# EAGLE design Sensor_Board_0x12_U-Value (EAGLE 8.2.2)
AUTOR: Luca Brügger
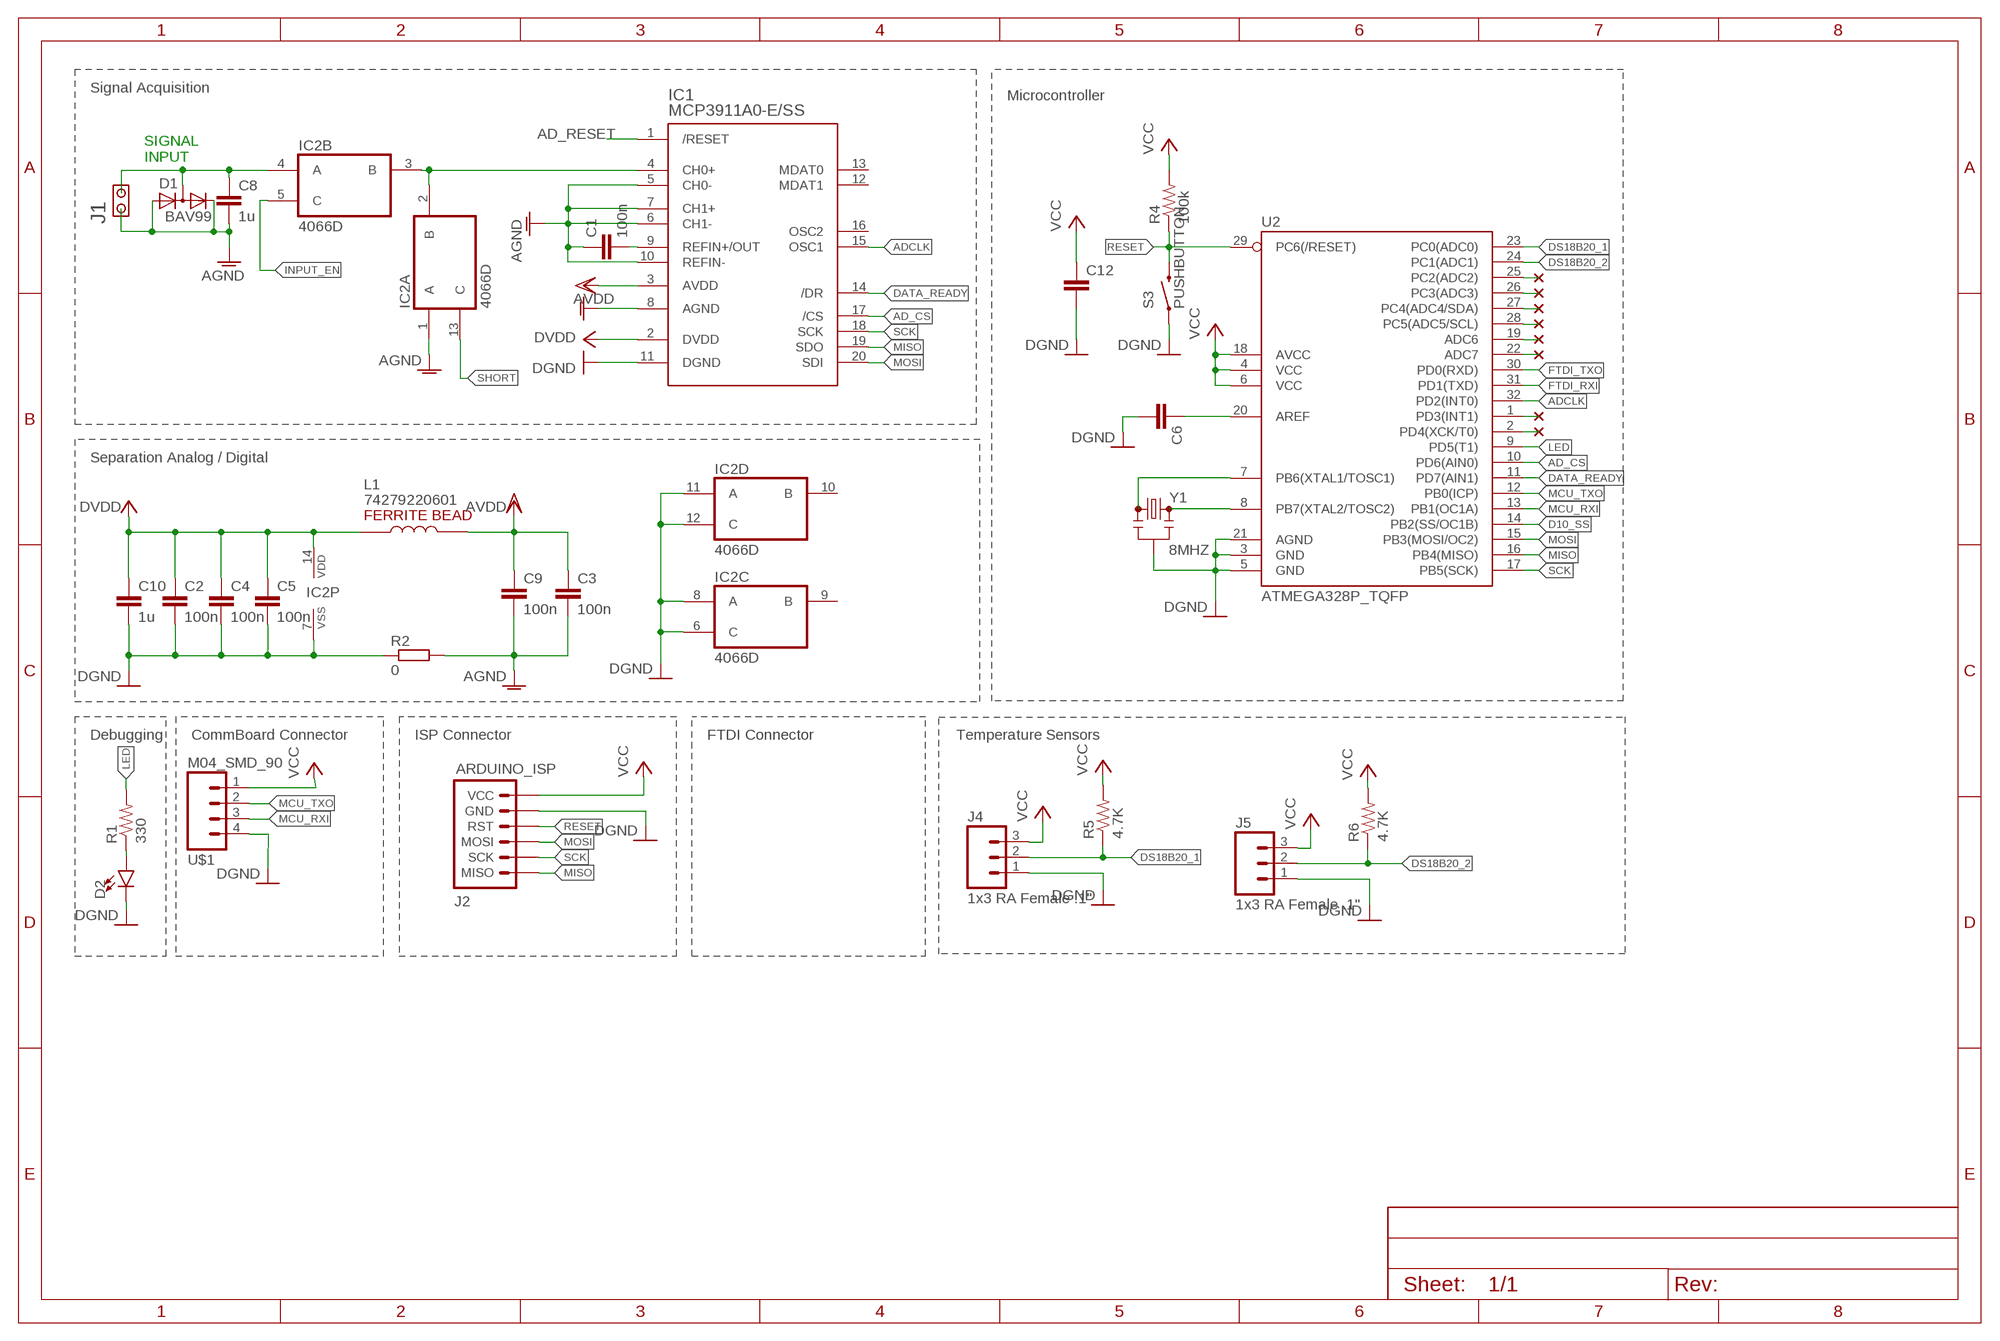
[diagram p0: schematic, sheet 1]
FRAME2 (FRAME-A4L): CNAME: Sensor Board 0x12 U-Value; CREVISION: 1.0

## Parts
C1  100n  C-EUC0805  [C0805]
C2  100n  C-EUC0805  [C0805]
C3  100n  C-EUC0805  [C0805]
C4  100n  C-EUC0805  [C0805]
C5  100n  C-EUC0805  [C0805]
C6  CAP0805  [0805]
C8  1u  C-EUC0805  [C0805]
C9  100n  C-EUC0805  [C0805]
C10  1u  C-EUC0805  [C0805]
C12  CAP0805  [0805]
D1  BAV99  [SOT23]
D2  LED0603  [LED-0603]
IC1  MCP3911A0-E/SS  [SSOP20]
IC2  4066D  [SO14]
J1  CON2X1  [CON2X1]
J2  ARDUINO_ISP  [M-2X3]
J4  1x3 RA Female .1"  M03SMD_RA_FEMALE  [1X03_SMD_RA_FEMALE]
J5  1x3 RA Female .1"  M03SMD_RA_FEMALE  [1X03_SMD_RA_FEMALE]
L1  74279220601  [0805]
R1  330  RESISTOR0805-RES  [0805]
R2  0  R-EU_M0805  [M0805]
R4  100k  RESISTOR0805-RES  [0805]
R5  4.7K  RESISTOR0805-RES  [0805]
R6  4.7K  RESISTOR0805-RES  [0805]
S3  PUSHBUTTON  [M-PUSHBUTTON-SMD]
U2  ATMEGA328P_TQFP  [TQFP32-08]
U$1  M04_SMD_90  [M04_SMD_90]
Y1  8MHZ  RESONATOR8MHZ  [RESONATOR-SMD]

## Nets
AD_CS: IC1.17(/CS) U2.10(PD6(AIN0))
AD_RESET: IC1.1(/RESET)
ADCLK: IC1.15(OSC1) U2.32(PD2(INT0))
AGND: C1.1 C3.2 C8.2 C9.2 D1.1(A) D1.2(C) IC1.5(CH0-) IC1.6(CH1-) IC1.7(CH1+) IC1.8(AGND) IC1.10(REFIN-) IC2.1(A:A) J1.1 R2.2
AVDD: C3.1 C9.1 IC1.3(AVDD) L1.2
D10_SS: U2.14(PB2(SS/OC1B))
DATA_READY: IC1.14(/DR) U2.11(PD7(AIN1))
DGND: C2.2 C4.2 C5.2 C10.2 IC1.11(DGND) IC2.6(C:C) IC2.7(P:VSS) IC2.8(C:A) IC2.11(D:A) IC2.12(D:C) R2.1
DS18B20_1: J4.2 R5.1 U2.23(PC0(ADC0))
DS18B20_2: J5.2 R6.1 U2.24(PC1(ADC1))
DVDD: C2.1 C4.1 C5.1 C10.1 IC1.2(DVDD) IC2.14(P:VDD) L1.1
FTDI_RXI: U2.31(PD1(TXD))
FTDI_TXO: U2.30(PD0(RXD))
GND: C6.2 C12.2 D2.C J2.P$5(GND) J5.1 S3.1(LEFT) S3.2(LEFT) U2.3(GND) U2.5(GND) U2.21(AGND) Y1.2 ; supply symbol labelled DGND
INPUT_EN: IC2.5(B:C)
LED: R1.2 U2.9(PD5(T1))
MCU_RXI: U2.13(PB1(OC1A)) U$1.3
MCU_TXO: U2.12(PB0(ICP)) U$1.2
MISO: IC1.19(SDO) J2.P$1(MISO) U2.16(PB4(MISO))
MOSI: IC1.20(SDI) J2.P$3(MOSI) U2.15(PB3(MOSI/OC2))
N$2: C1.2 IC1.9(REFIN+/OUT)
N$3: C6.1 U2.20(AREF)
N$4: U$1.4
N$6: U2.25(PC2(ADC2))
N$7: U2.26(PC3(ADC3))
N$8: IC1.4(CH0+) IC2.2(A:B) IC2.3(B:B)
N$9: U2.27(PC4(ADC4/SDA))
N$10: U2.28(PC5(ADC5/SCL))
N$11: U2.19(ADC6)
N$12: C8.1 D1.3(AC) IC2.4(B:A) J1.2
N$13: U2.22(ADC7)
N$15: J4.1
N$17: U2.1(PD3(INT1))
N$18: U2.2(PD4(XCK/T0))
N$23: U2.8(PB7(XTAL2/TOSC2)) Y1.3
N$24: D2.A R1.1
N$25: U2.7(PB6(XTAL1/TOSC1)) Y1.1
RESET: J2.P$4(RST) R4.1 S3.3(RIGHT) S3.4(RIGHT) U2.29(PC6(/RESET))
SCK: IC1.18(SCK) J2.P$2(SCK) U2.17(PB5(SCK))
SHORT: IC2.13(A:C)
VCC: C12.1 J2.P$6(VCC) J4.3 J5.3 R4.2 R5.2 R6.2 U2.4(VCC) U2.6(VCC) U2.18(AVCC) U$1.1
Unconnected: IC1.12(MDAT1) IC1.13(MDAT0) IC1.16(OSC2) IC2.9(C:B) IC2.10(D:B)

## Notes on the sheet
- Signal Acquisition
- Microcontroller
- SIGNAL
  INPUT
- Separation Analog / Digital
- Debugging | CommBoard Connector | ISP Connector | FTDI Connector | Temperature Sensors

## Library data of the parts
C1-C5 C8-C10 = heatflow:C-EU: CAPACITOR, European symbol
C6 C12 = wsn:CAP: Capacitor Standard 0603 ceramic capacitor, and 0.1" leaded capacitor.
D1 = LEDXLamp:BAV99
D2 = wsn:LED: LED (Generic) Standard schematic elements and footprints for 5mm, 3mm, 1206, and 0603 sized LEDs. Generic LEDs with no color specified.
IC1 = heatflow:MCP3911A0-E/*
IC2 = 40xx:4066: Quad bilateral ANALOG SWITCH
J1 = Stecker_Pins:CON2X1: Pin-Leiste, 2*1
J2 = wsn:ARDUINO_ISP: AVR ISP 6-pin inline header for Arduino ISP
J4 J5 = wsn:M03: Header 3 Standard 3-pin 0.1" header. Use with straight break away headers (SKU : PRT-00116), right angle break away headers (PRT-00553), swiss pins (PRT-00743), machine pins (PRT-00117), and female headers (PRT-00115). Molex polarized connector foot print use with SKU : PRT-08232 with associated crimp pins and housings.; PROD_ID: CONN-10926
L1 = heatflow2:74279220601: Multilayer Bead SMD, Würth Elektronik Typ: 74279220601
R1 R4-R6 = wsn:RESISTOR: Resistor Basic schematic elements and footprints for 0603, 1206, and PTH resistors.
R2 = resistor:R-EU_: RESISTOR, European symbol
S3 = wsn:PUSHBUTTON
U2 = wsn:ATMEGA328P_TQFP; PROD_ID: IC-09069
U$1 = wsn:M04_SMD_90
Y1 = wsn:RESONATOR: Resonator Small SMD resonator. Used, eg, on the Arduino Pro/ Pro Mini boards. 8MHz- XTAL-08895 16MHz- XTAL-08900; PROD_ID: XTAL-08895

## Board
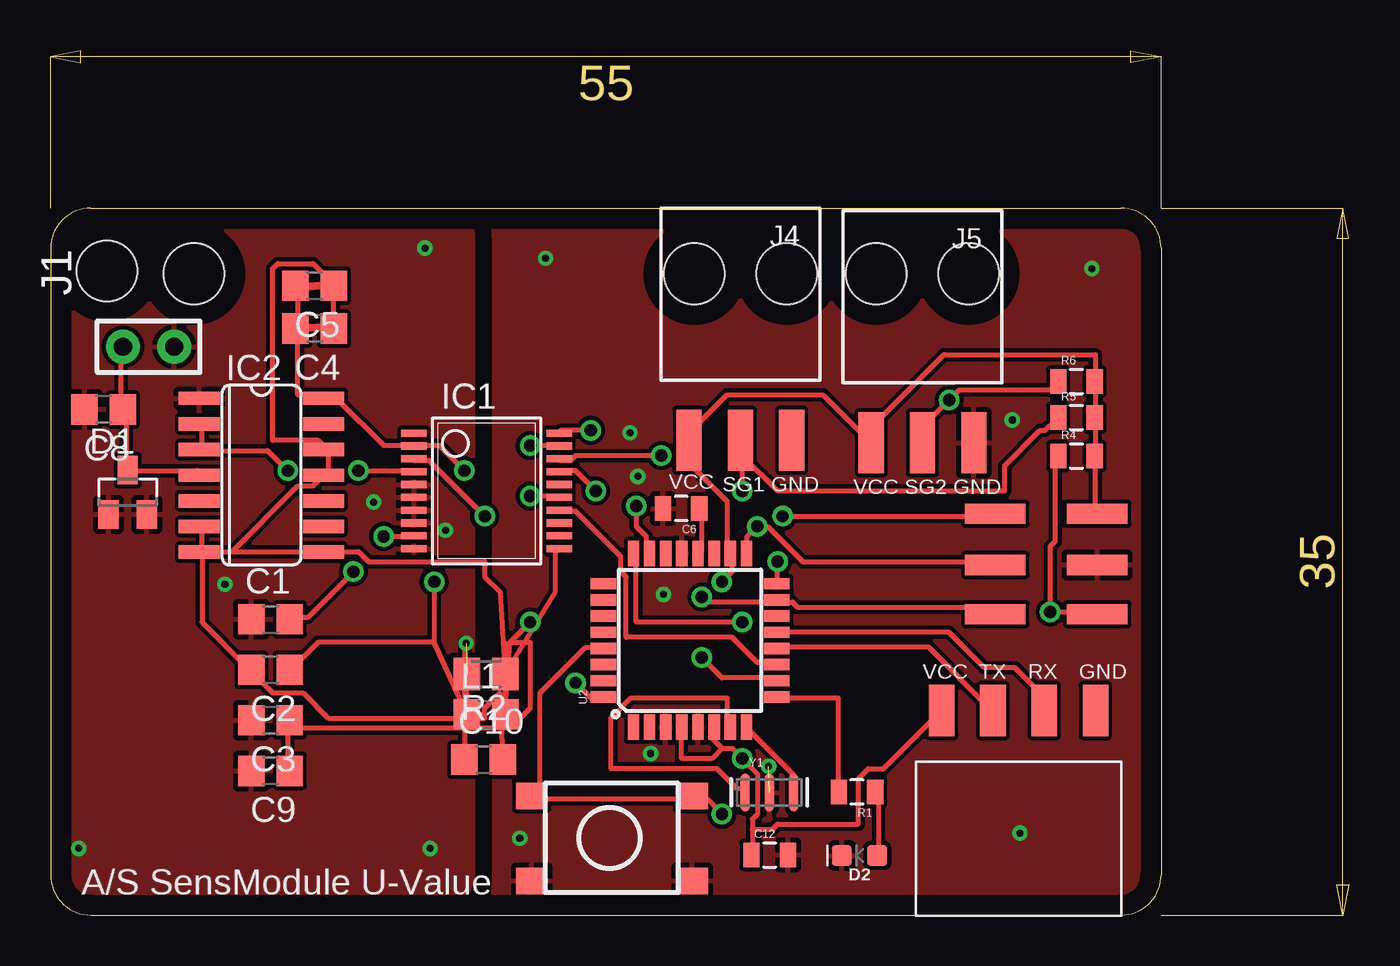
[diagram p1: board, top side]
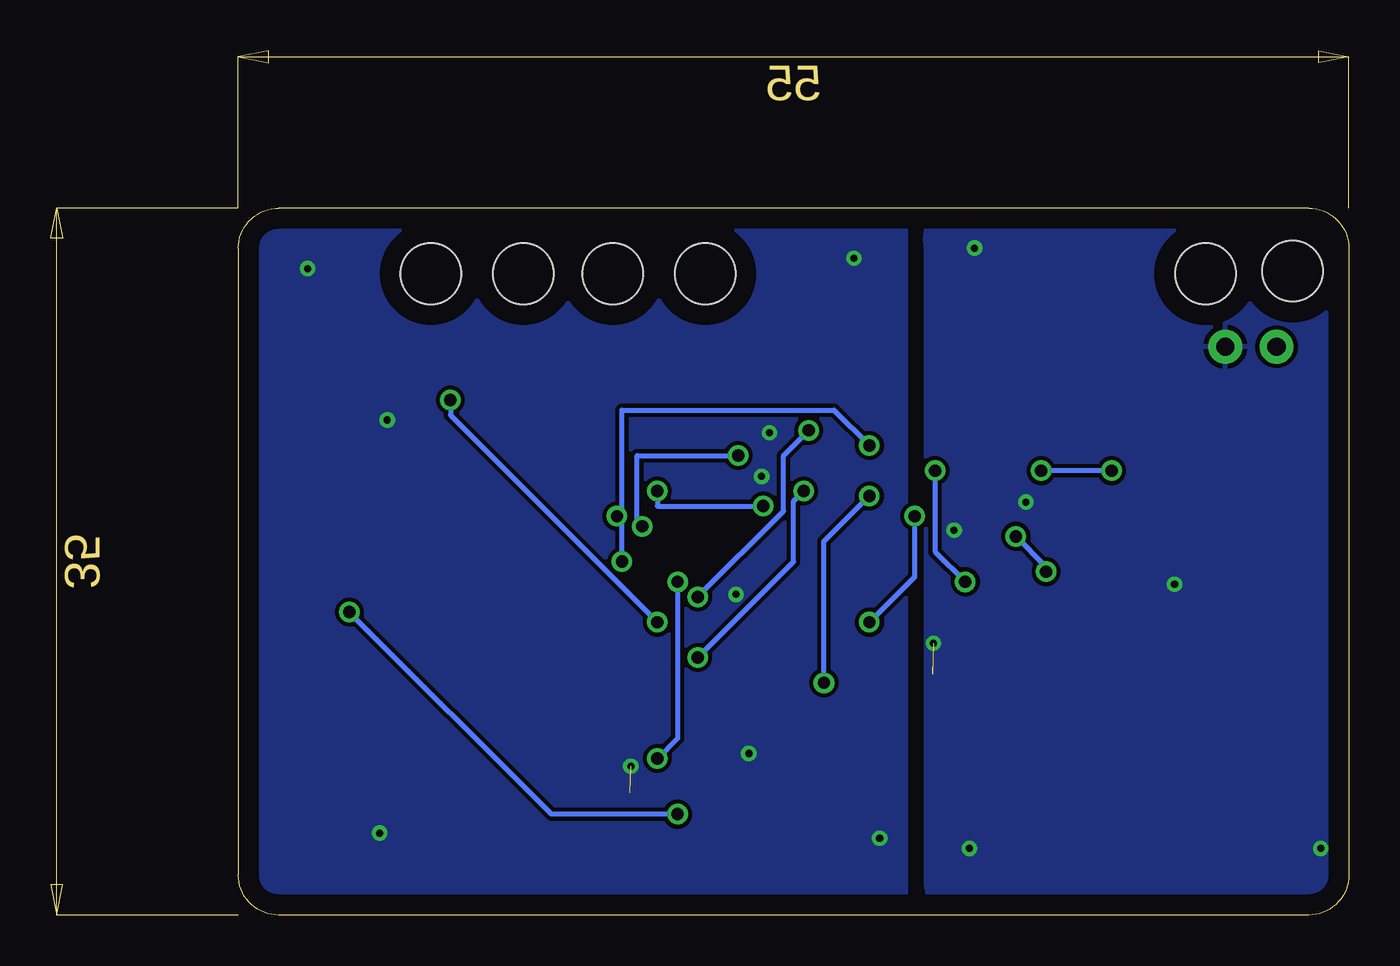
[diagram p2: board, bottom side, seen from below]

Size 55 x 35 mm. Coordinates in mm from the lower left corner, seen from the top.
Outline: 0,2 arc90 2,0 53,0 arc90 55,2 55,33 arc90 53,35 2,35 arc90 0,33 0,2
Copper layers (1*16): Top 0.035mm / dielectric 1.5mm / Bottom 0.035mm
Design rules "default *": minimum track width 10mil, minimum drill 24mil, track to track 8mil, track to pad 8mil, pad to pad 8mil, via to via 8mil, smd to smd 8mil, copper to edge 40mil, drill to drill 8mil, minimum pad ring 10mil, minimum via ring 8mil, stop-mask expansion 4mil, vias tented up to drill 0mil, thermal gap 10mil
Holes 3 mm at 2.79,31.88 7.11,31.75 31.88,31.75 40.89,31.75 36.45,31.75 45.47,31.75

### Footprints (pad centres in the part's own frame; a part is rotated, then mirrored left to right if it is on the bottom)
C0805 = smd 1.3 x 1.5: 1 -0.95,0; 2 0.95,0
0805 = smd 0.8 x 1.2: 1 -0.9,0; 2 0.9,0
SOT23 = smd 1 x 1.4: 1 -0.95,-1.1; 2 0.95,-1.1; 3 0,1.1
LED-0603 = smd 1 x 1: A -0.877,0; C 0.877,0
SSOP20 = smd 0.35 x 1.245: 1 -2.857,-3.45; 2 -2.222,-3.45; 3 -1.587,-3.45; 4 -0.952,-3.45; 5 -0.317,-3.45; 6 0.318,-3.45; 7 0.953,-3.45; 8 1.588,-3.45; 9 2.223,-3.45; 10 2.858,-3.45; 11 2.858,3.75; 12 2.223,3.75; 13 1.588,3.75; 14 0.953,3.75; 15 0.318,3.75; 16 -0.317,3.75; 17 -0.952,3.75; 18 -1.587,3.75; 19 -2.222,3.75; 20 -2.857,3.75
SO14 = smd 0.66 x 2.032: 1 -3.81,-3.073; 2 -2.54,-3.073; 3 -1.27,-3.073; 4 0,-3.073; 5 1.27,-3.073; 6 2.54,-3.073; 7 3.81,-3.073; 8 3.81,3.073; 9 2.54,3.073; 10 1.27,3.073; 11 0,3.073; 12 -1.27,3.073; 13 -2.54,3.073; 14 -3.81,3.073
CON2X1 = drill 0.9 pad 1.676: 1 0,0; 2 0,2.54
M-2X3 = smd 1 x 3: P$1 0,0; P$2 2.54,0; P$3 4.98,0; P$4 4.98,5.05; P$5 2.54,5.05; P$6 0,5.05
1X03_SMD_RA_FEMALE = smd 1.25 x 3: 1 -2.54,7.225; 2 0,7.225; 3 2.54,7.225
0805' = smd 1.3 x 1.5: 1 -0.95,0; 2 0.95,0
M0805 = smd 1.3 x 1.6: 1 -0.95,0; 2 0.95,0
M-PUSHBUTTON-SMD = smd 1.55 x 1.3: 1 0,0; 2 7.95,0; 3 0,-4.2; 4 7.95,-4.2
TQFP32-08 = smd 1.27 x 0.559: 1 -4.293,2.8; 2 -4.293,2; 3 -4.293,1.2; 4 -4.293,0.4; 5 -4.293,-0.4; 6 -4.293,-1.2; 7 -4.293,-2; 8 -4.293,-2.8; 17 4.293,-2.8; 18 4.293,-2; 19 4.293,-1.2; 20 4.293,-0.4; 21 4.293,0.4; 22 4.293,1.2; 23 4.293,2; 24 4.293,2.8 | smd 0.559 x 1.27: 9 -2.8,-4.293; 10 -2,-4.293; 11 -1.2,-4.293; 12 -0.4,-4.293; 13 0.4,-4.293; 14 1.2,-4.293; 15 2,-4.293; 16 2.8,-4.293; 25 2.8,4.293; 26 2,4.293; 27 1.2,4.293; 28 0.4,4.293; 29 -0.4,4.293; 30 -1.2,4.293; 31 -2,4.293; 32 -2.8,4.293
M04_SMD_90 = smd 1.27 x 2.54: 1 0,0; 2 2.54,0; 3 5.08,0; 4 7.62,0
RESONATOR-SMD = smd 0.45 x 1.905: 1 -1.2,0; 2 0,0; 3 1.2,0

### Placement (x,y rotation side)
C1  10.9,14.64 0 top
C2  10.9,12.14 180 top
C3  10.9,9.64 180 top
C4  13.08,29.03 180 top
C5  13.08,31.15 180 top
C6  31.23,20.13 180 top
C8  2.64,25.03 180 top
C9  10.9,7.14 180 top
C10  21.44,7.7 0 top
C12  35.61,2.98 0 top
D1  3.83,20.94 0 top
D2  40.06,2.95 180 top
IC1  21.44,21 270 top
IC2  10.44,21.78 270 top
J1  6.13,28.14 90 top
J2  46.78,19.87 270 top
J4  34.16,30.73 180 top
J5  43.18,30.61 180 top
L1  74279220601  [0805']  21.57,9.94 0 top
R1  39.94,6.09 180 top
R2  21.57,11.94 180 top
R4  50.8,22.73 0 top
R5  50.8,24.64 0 top
R6  50.8,26.42 0 top
S3  31.78,1.7 180 top
U2  31.67,13.6 90 top
U$1  44.13,10.13 0 top
Y1  35.59,6.07 0 top

### Tracks (layer width: path | path; a pad name or v marks a point on that pad's centre or on a via)
AD_CS  (via drill 0.61)
  Top 0.254: v27,21 26,22 25.25,22 IC1.17 | v32.25,12.75 33.25,11.75 35.75,11.75 U2.10
  Bottom 0.254: v27,21 27.5,20.5 27.5,17.5 v32.25,12.75
ADCLK  (via drill 0.61)
  Top 0.254: v23.75,20.75 25,20.75 IC1.15 | v26,11.5 26.75,10.75 27.25,10.75 U2.32
  Bottom 0.254: v23.75,20.75 26,18.5 v26,11.5
AGND  (via drill 0.35)  (1 unrouted)
  other vias: 18.8,3.3 1.4,3.3 18.54,33.02 16,20.45 19.56,19.05 20.57,13.46 8.64,16.38
  pour Bottom: 18.94,36 2,36 arc90 -1,33 -1,2 arc90 2,-1 17.94,-1 arc90 20.94,1.5 20.94,33 arc90
  pour Top: 0,33 0,2 arc90 2,0 18.94,0 arc90 20.94,2.5 20.94,33.5 arc90 19.44,35 2,35 arc90
AVDD  (via drill 0.61)
  Top 0.254: C9.1 11.75,7.25 11.75,9.5 C3.1 12,9.5 12.25,9.25 22.75,9.25 23.75,10.25 23.75,13.5 22.75,13.5 | v21.5,19.75 18.75,22.5 18,22.5 IC1.3 | 22.75,13.5 v23.75,14.5 | 22.75,13.5 L1.2 22.5,13.5
  Bottom 0.254: v21.5,19.75 21.5,16.75 v23.75,14.5
DATA_READY
  Top 0.254: IC1.14 25.25,20 26,20 28.25,17.75 28.25,17 28.5,16.75 28.5,13.75 33.75,13.75 35,12.5 35.75,12.5 U2.11
DGND
  Top 0.254: C4.2 14,29.25 14,31 C5.2 14,31.25 13,32.25 11.25,32.25 11,32 11,23.5 13.25,23.5 13.5,23.25 IC2.12 13.75,23 13.75,22 IC2.11 13.5,21.75 13,21.25 12.25,21.25 9,18 | IC1.11 25,18 25,16 R2.1 22.25,16 21.5,16.75 21.5,17.5 15.75,17.5 15.25,18 13.75,18 IC2.8 13.5,18 9,18 | C10.2 22.25,11 21.5,10.25 21.5,9.75 13.75,9.75 12.5,11 11,11 10,12 C2.2 9.75,12.25 7.5,14.5 7.5,17.75 IC2.7 7.5,18 | 7.5,18 7.5,19 IC2.6 | 7.5,18 9,18
DS18B20_1  (via drill 0.61)
  Top 0.254: 34.25,22.75 36,21 47.25,21 47.25,22.25 49,24 49.25,24 49.75,24.5 R5.1 | 34.25,22.75 34.25,23.5 J4.2 34.25,22.75 | v29,20.25 29,19.25 29.5,18.75 29.5,18 U2.23 | 34.25,22.75 v34.25,21
  Bottom 0.254: v29,20.25 34.25,20.25 v34.25,21
DS18B20_2  (via drill 0.61)
  Top 0.254: R6.1 49.75,26.25 49.5,26 45,26 v44.5,25.5 43.25,24.25 43.25,23.5 J5.2 | v34.25,14.5 29,14.5 29,17.75 U2.24
  Bottom 0.254: v34.25,14.5 44.5,24.75 v44.5,25.5
DVDD  (via drill 0.61)
  Top 0.254: 19,13.5 L1.1 20.5,13.5 20.5,11 C10.1 | 19,13.5 13.25,13.5 12,12.25 C2.1 | C5.1 12.25,31 12.25,29.25 C4.1 12.25,29 12.25,25.75 13.5,25.75 IC2.14 13.75,25.5 14.25,25.5 16.5,23.25 17.75,23.25 IC1.2 18,23.25 19.25,23.25 v20.5,22 | v19,16.5 19,13.5
  Bottom 0.254: v19,16.5 20.5,18 v20.5,22
GND  (via drill 0.35)  (1 unrouted)
  other vias: 24.51,32.51 51.56,32 48.01,4.06 23.24,3.81 47.62,24.51 30.35,15.88 29.08,21.72 29.72,8 28.7,23.88 35.56,7.37
  pour Bottom: 56,33 arc90 53,36 23.44,36 arc90 21.94,34 21.94,1 arc90 23.94,-1 53,-1 arc90 56,2
  pour Top: 21.94,33.5 21.94,1.5 arc90 22.94,0 53,0 arc90 55,2 55,33 arc90 53,35 22.94,35 arc90
LED
  Top 0.254: R1.2 39,6.25 39,10.75 36,10.75 U2.9
MCU_RXI
  Top 0.254: U2.13 36,14 44.5,14 46.25,12.25 47.75,12.25 49,11 49,10.25 U$1.3
MCU_TXO
  Top 0.254: U2.12 36,13.25 43.5,13.25 46.5,10.25 U$1.2
MISO  (via drill 0.61)
  Top 0.254: v23.75,23.25 25,23.25 IC1.19 | v36,17.5 36,16.5 U2.16 | v36.25,19.75 46.75,19.75 J2.P$1
  Bottom 0.254: v23.75,23.25 25.5,25 36,25 36,19.75 | v36,17.5 36,19.75 | 36,19.75 v36.25,19.75
MOSI  (via drill 0.61)
  Top 0.254: v26.75,24 25.25,24 IC1.20 | v32.25,15.75 32.5,15.5 35.75,15.5 U2.15 36,15.5 36.75,15.5 37,15.25 46.5,15.25 46.75,15 J2.P$3
  Bottom 0.254: v26.75,24 28,22.75 28,20 v32.25,15.75
N$2  (via drill 0.61)
  Top 0.254: v16.5,18.75 17.75,18.75 IC1.9 | v15,17 12.75,14.75 12,14.75 C1.2
  Bottom 0.254: v16.5,18.75 15,17.25 v15,17
N$3
  Top 0.254: C6.1 32.25,20 32.25,18 U2.20
N$8  (via drill 0.61)
  Top 0.254: v15.25,22 17.75,22 IC1.4 | v11.75,22 10.75,23 7.5,23 IC2.3 7.5,23.25 7.5,24.25 IC2.2
  Bottom 0.254: v11.75,22 v15.25,22
N$12
  Top 0.254: IC2.4 7.25,22 4,22 D1.3 3.75,22.25 3.75,25 C8.1 3.5,25.25 3.5,28 J1.2
N$23
  Top 0.254: U2.8 34.5,9.25 36.75,7 36.75,6.25 Y1.3
N$24
  Top 0.254: D2.A 41,3 41,6 R1.1
N$25
  Top 0.254: U2.7 33.5,9.5 33.5,10.75 28.75,10.75 27.75,9.75 27.75,7.25 33,7.25 34,6.25 34.25,6.25 Y1.1
RESET  (via drill 0.61)
  Top 0.254: R4.1 49.75,22.5 49.75,18.5 49.5,18.25 v49.5,15 51.75,15 J2.P$4 | U2.29 27.25,13.25 26.5,13.25 24.25,11 24.25,6 24,6 S3.4 24,5.75 31.75,5.75 S3.3 32,5.75 32.5,5.75 v33.25,5
  Bottom 0.254: v49.5,15 39.5,5 v33.25,5
SCK  (via drill 0.61)
  Top 0.254: v30.25,22.75 26,22.75 25.75,22.5 25.25,22.5 IC1.18 | U2.17 34.5,18 34.5,18.75 v35,19.25 35.5,19.25 37.25,17.5 46.75,17.5 J2.P$2
  Bottom 0.254: v30.25,22.75 35.25,22.75 35.25,19.5 v35,19.25
VCC  (via drill 0.61)
  Top 0.254: 34.75,4.25 34.75,4.75 35,5 35,7 v34.25,7.75 33.75,8.25 33.25,8.25 | 34.75,4.25 34.75,3 C12.1 | 33.25,8.25 32.75,8.75 32.75,9.25 U2.6 | 33.25,8.25 32.75,7.75 31.25,7.75 31.25,9.25 U2.4 | U$1.1 41.25,7.25 40.5,7.25 40,6.75 40,4.5 36,4.5 35.75,4.25 34.75,4.25 | J2.P$6 51.75,20 51.75,22.5 R4.2 51.75,22.75 51.75,24.5 R5.2 51.75,24.75 51.75,26.25 R6.2 51.75,26.5 51.75,27.75 44.25,27.75 40.25,23.75 | 40.25,23.75 38.25,25.75 33.5,25.75 31.5,23.75 J4.3 31.75,23.5 31.75,22.25 33.5,20.5 33.5,18 U2.18 33.75,17.75 33.75,17 v33.25,16.5 | 40.25,23.75 40.5,23.5 J5.3 40.25,23.75
  Bottom 0.254: v34.25,7.75 33.25,8.75 v33.25,16.5

### Text on the board
tPlace: VCC | SG1 | GND | VCC | SG2 | GND | VCC | TX | RX | GND | A/S SensModule U-Value